# EAGLE design quad87 (EAGLE 7.7.0)
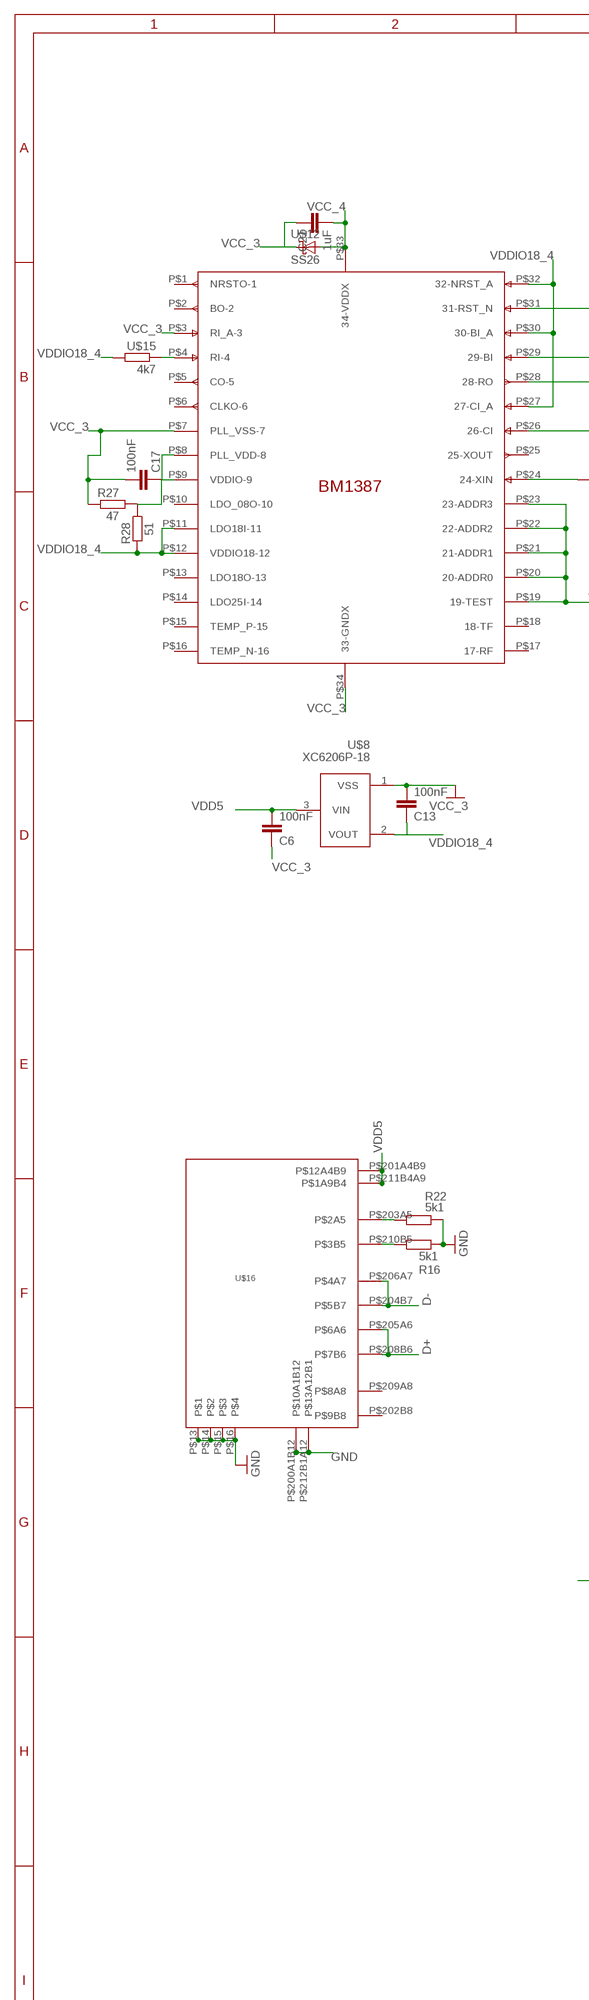
[diagram p0: schematic, sheet 1, part 1 of 2]
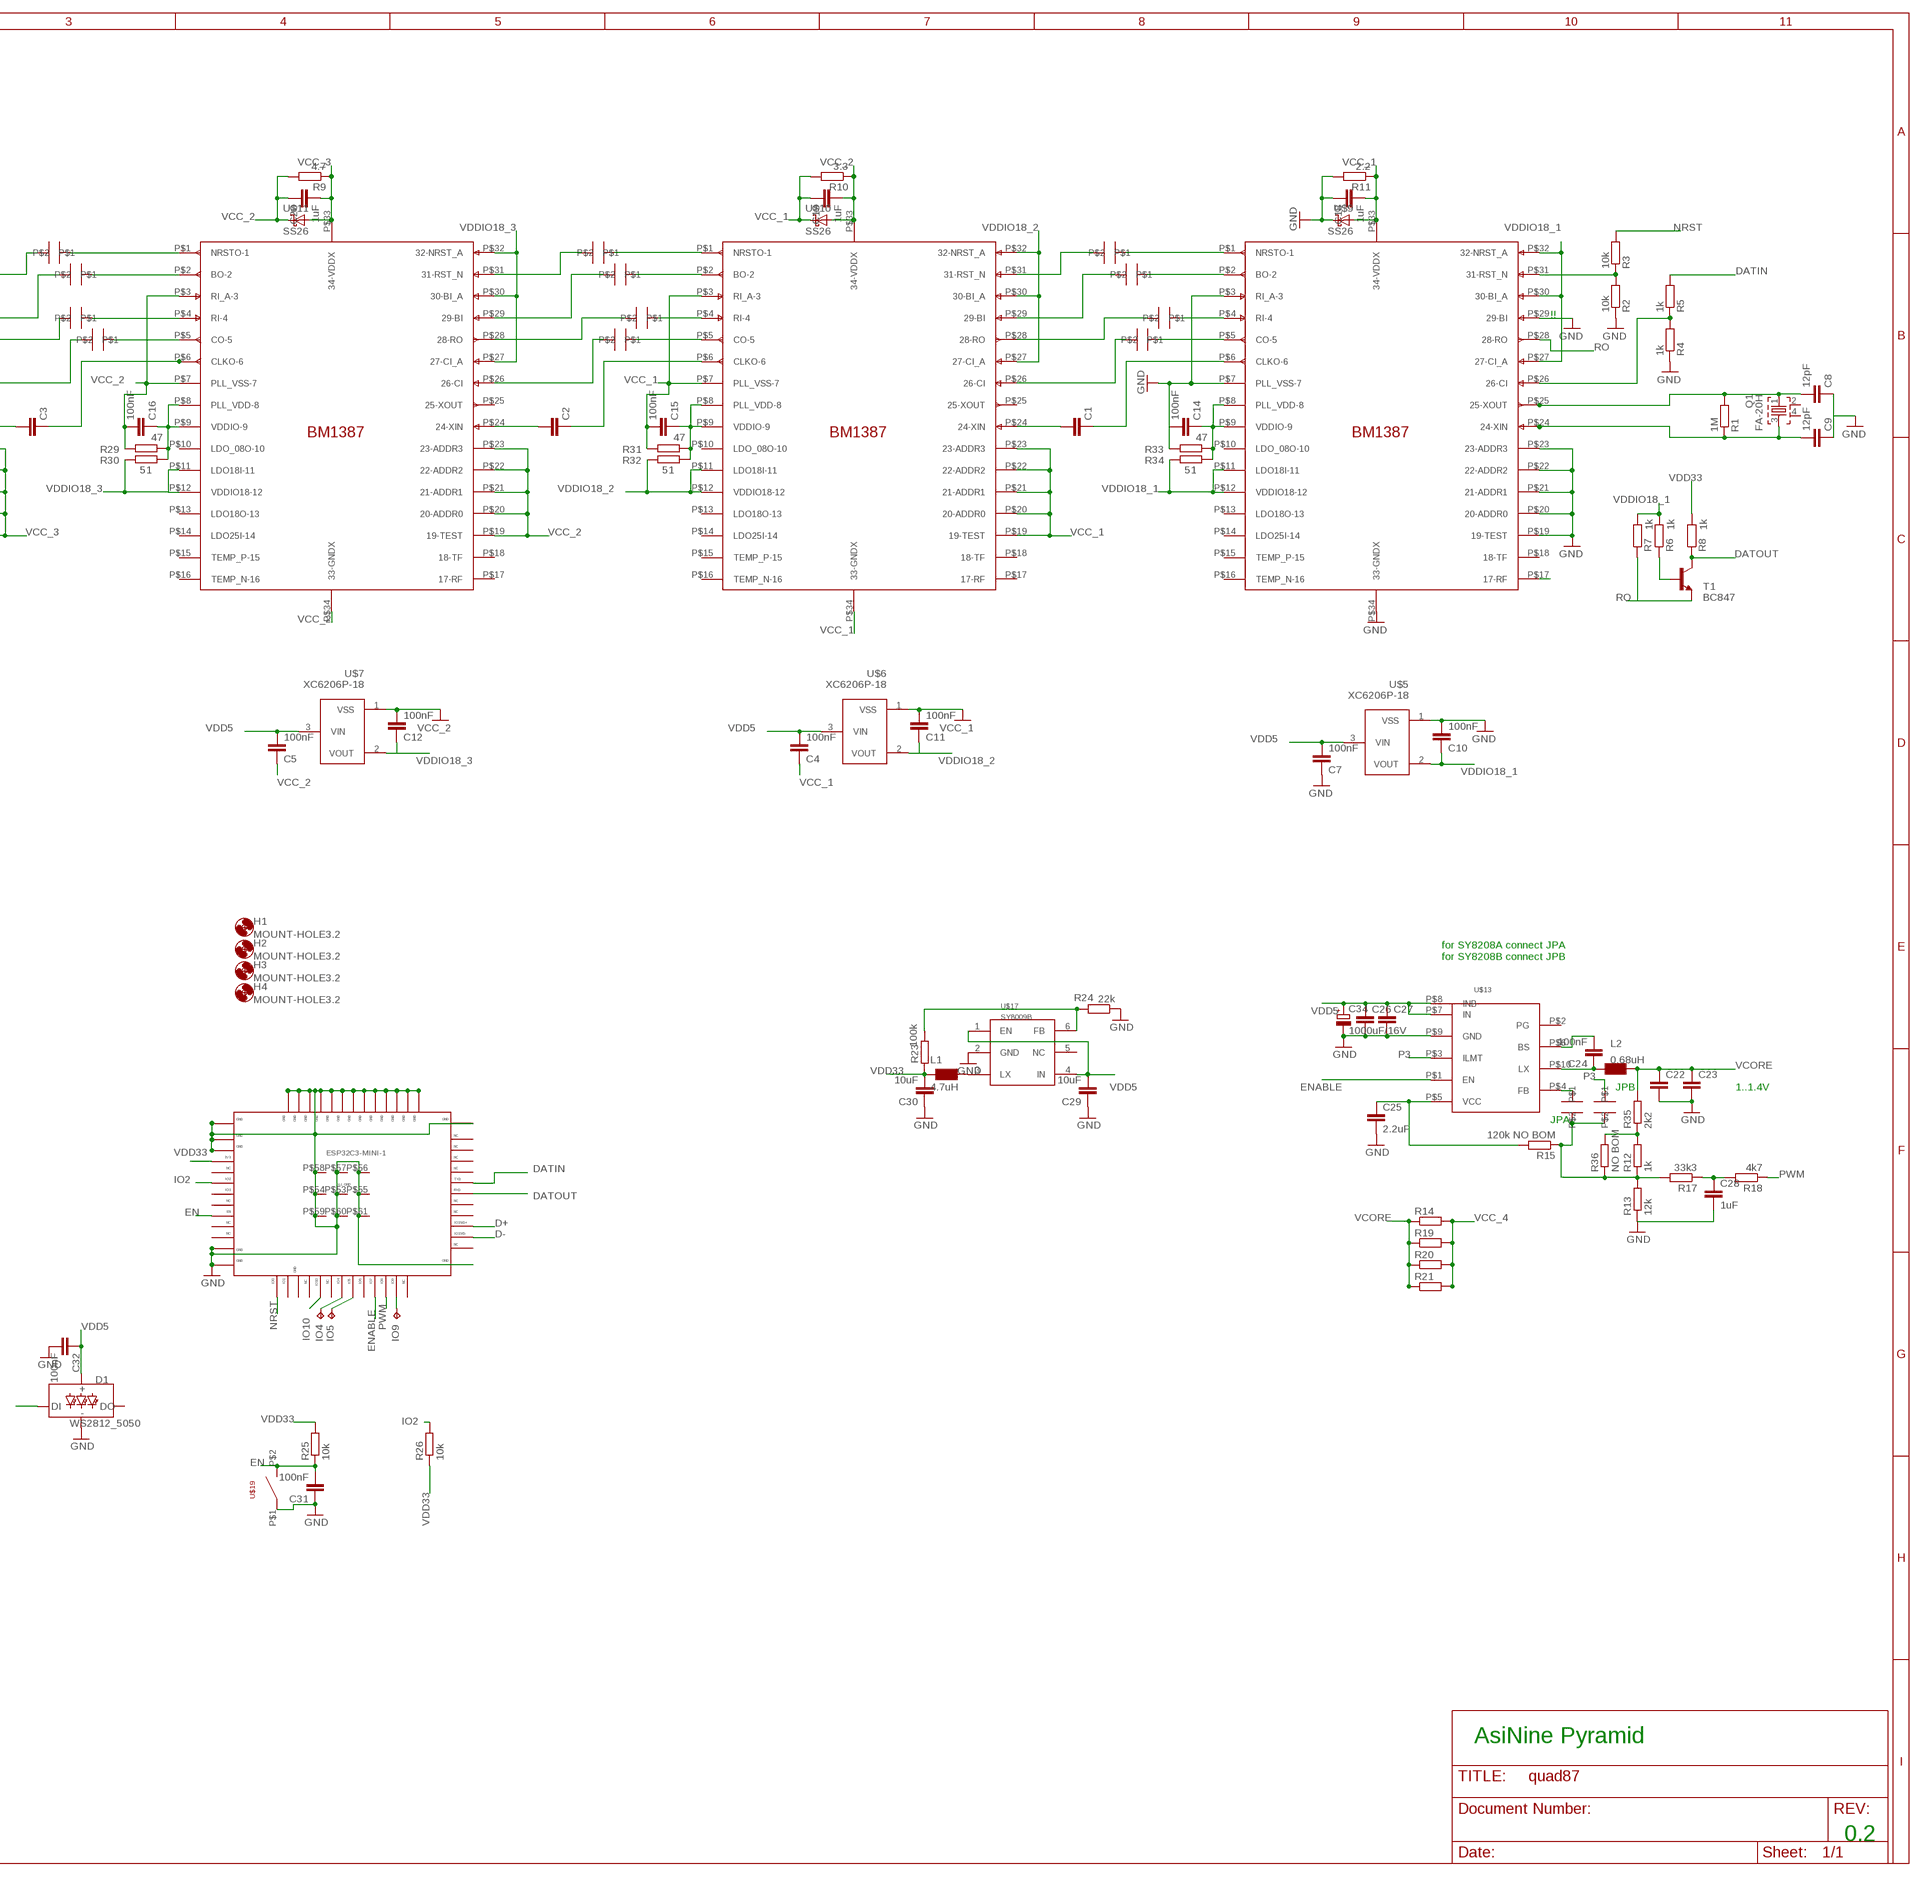
[diagram p1: schematic, sheet 1, part 2 of 2]

## Parts
C1  C-EUC0402  [C0402]
C2  C-EUC0402  [C0402]
C3  C-EUC0402  [C0402]
C4  100nF  C-EUC0603  [C0603]
C5  100nF  C-EUC0603  [C0603]
C6  100nF  C-EUC0603  [C0603]
C7  100nF  C-EUC0603  [C0603]
C8  12pF  C-EUC0402  [C0402]
C9  12pF  C-EUC0402  [C0402]
C10  100nF  C-EUC0603  [C0603]
C11  100nF  C-EUC0603  [C0603]
C12  100nF  C-EUC0603  [C0603]
C13  100nF  C-EUC0603  [C0603]
C14  100nF  C-EUC0402  [C0402]
C15  100nF  C-EUC0402  [C0402]
C16  100nF  C-EUC0402  [C0402]
C17  100nF  C-EUC0402  [C0402]
C18  1uF  C-EUC0603  [C0603]
C19  1uF  C-EUC0603  [C0603]
C20  1uF  C-EUC0603  [C0603]
C21  1uF  C-EUC0603  [C0603]
C22  C-EUC1210K  [C1210K]
C23  C-EUC1210K  [C1210K]
C24  100nF  C-EUC0603  [C0603]
C25  2.2uF  C-EUC0603  [C0603]
C26  C-EUC0805  [C0805]
C27  C-EUC0805  [C0805]
C28  1uF  C-EUC0603  [C0603]
C29  10uF  C-EUC0603  [C0603]
C30  10uF  C-EUC0603  [C0603]
C31  100nF  C-EUC0603  [C0603]
C32  100nF  C-EUC0603  [C0603]
C34  1000uF/16V  CPOL-EUTT5D10  [TT5D10]
D1  WS2812_5050  [WS2812-5X5-4PIN]
ESP32C3-MINI-1  ESP32-C3-MINI-1  ESP32C3MINI  [ESP32C3MINI]
H1  MOUNT-HOLE3.2  [3,2]
H2  MOUNT-HOLE3.2  [3,2]
H3  MOUNT-HOLE3.2  [3,2]
H4  MOUNT-HOLE3.2  [3,2]
IO4  TPB1,27  [B1,27]
IO5  TPB1,27  [B1,27]
IO9  TPB1,27  [B1,27]
JPA  SOLDERJUMPER  [SOLDERJUMPER]
JPB  SOLDERJUMPER  [SOLDERJUMPER]
L1  4.7uH  L0420  [L0420]
L2  0.68uH  L0630  [L0630]
Q1  FA-20H  [FA-20H]
R1  1M  R-EU_R0402  [R0402]
R2  10k  R-EU_R0402  [R0402]
R3  10k  R-EU_R0402  [R0402]
R4  1k  R-EU_R0603  [R0603]
R5  1k  R-EU_R0603  [R0603]
R6  1k  R-EU_R0603  [R0603]
R7  1k  R-EU_R0603  [R0603]
R8  1k  R-EU_R0603  [R0603]
R9  4.7  R-EU_R0603  [R0603]
R10  3.3  R-EU_R0603  [R0603]
R11  2.2  R-EU_R0603  [R0603]
R12  1k  R-EU_R0603  [R0603]
R13  12k  R-EU_R0603  [R0603]
R14  R-EU_R2010  [R2010]
R15  120k NO BOM  R-EU_R0603  [R0603]
R16  5k1  R-EU_R0402  [R0402]
R17  33k3  R-EU_R0603  [R0603]
R18  4k7  R-EU_R0603  [R0603]
R19  R-EU_R2010  [R2010]
R20  R-EU_R2010  [R2010]
R21  R-EU_R2010  [R2010]
R22  5k1  R-EU_R0402  [R0402]
R23  100k  R-EU_R0603  [R0603]
R24  22k  R-EU_R0603  [R0603]
R25  10k  R-EU_R0603  [R0603]
R26  10k  R-EU_R0603  [R0603]
R27  47  R-EU_R0402  [R0402]
R28  51  R-EU_R0402  [R0402]
R29  47  R-EU_R0402  [R0402]
R30  51  R-EU_R0402  [R0402]
R31  47  R-EU_R0402  [R0402]
R32  51  R-EU_R0402  [R0402]
R33  47  R-EU_R0402  [R0402]
R34  51  R-EU_R0402  [R0402]
R35  2k2  R-EU_R0603  [R0603]
R36  NO BOM  R-EU_R0603  [R0603]
T1  BC847  [SOT23]
U$1  BM1387A  [BM1391]
U$2  BM1387A  [BM1391]
U$3  BM1387A  [BM1391]
U$4  BM1387A  [BM1391]
U$5  XC6206P-18  XC6206P  [SOT23]
U$6  XC6206P-18  XC6206P  [SOT23]
U$7  XC6206P-18  XC6206P  [SOT23]
U$8  XC6206P-18  XC6206P  [SOT23]
U$9  SS26  [SS26]
U$10  SS26  [SS26]
U$11  SS26  [SS26]
U$12  SS26  [SS26]
U$13  SY8208  [SY8208]
U$15  4k7  R0603  [R0603]
U$16  USBCTHT  [USBCSMTTHT]
U$17  SY8009B  [SOT23-6]
U$19  SMDSW6X3  [SW6X3]
U$20  SOLDERJUMPER  [SOLDERJUMPER]
U$21  SOLDERJUMPER  [SOLDERJUMPER]
U$22  SOLDERJUMPER  [SOLDERJUMPER]
U$23  SOLDERJUMPER  [SOLDERJUMPER]
U$24  SOLDERJUMPER  [SOLDERJUMPER]
U$25  SOLDERJUMPER  [SOLDERJUMPER]
U$26  SOLDERJUMPER  [SOLDERJUMPER]
U$28  SOLDERJUMPER  [SOLDERJUMPER]
U$29  SOLDERJUMPER  [SOLDERJUMPER]
U$30  SOLDERJUMPER  [SOLDERJUMPER]
U$31  SOLDERJUMPER  [SOLDERJUMPER]
U$32  SOLDERJUMPER  [SOLDERJUMPER]

## Nets
CI: R4.2 R5.1 U$1.P$26(26-CI)
D+: ESP32C3-MINI-1.P$27 U$16.P$205A6(P$6A6) U$16.P$208B6(P$7B6)
D-: ESP32C3-MINI-1.P$26 U$16.P$204B7(P$5B7) U$16.P$206A7(P$4A7)
DATIN: ESP32C3-MINI-1.P$31 R5.2
DATOUT: ESP32C3-MINI-1.P$30 R8.1 T1.3(C)
EN: C31.2 ESP32C3-MINI-1.P$8 R25.1 U$19.P$2
ENABLE: ESP32C3-MINI-1.P$21 U$13.P$1(EN)
FB: JPA.P$1 JPB.P$1 R12.1 R13.2 R15.1 R17.2 R36.1
GND: C7.1 C8.1 C9.1 C10.2 C14.2 C18.1 C22.2 C23.2 C25.2 C26.2 C27.2 C28.2 C29.1 C30.1 C31.1 C32.2 C34.- D1.GND ESP32C3-MINI-1.P$1 ESP32C3-MINI-1.P$2 ESP32C3-MINI-1.P$11 ESP32C3-MINI-1.P$36 ESP32C3-MINI-1.P$37 ESP32C3-MINI-1.P$38 ESP32C3-MINI-1.P$39 ESP32C3-MINI-1.P$40 ESP32C3-MINI-1.P$41 ESP32C3-MINI-1.P$42 ESP32C3-MINI-1.P$43 ESP32C3-MINI-1.P$44 ESP32C3-MINI-1.P$45 ESP32C3-MINI-1.P$46 ESP32C3-MINI-1.P$47 ESP32C3-MINI-1.P$48 ESP32C3-MINI-1.P$49 ESP32C3-MINI-1.P$50 ESP32C3-MINI-1.P$51 ESP32C3-MINI-1.P$52 ESP32C3-MINI-1.P$53 ESP32C3-MINI-1.P$54 ESP32C3-MINI-1.P$55 ESP32C3-MINI-1.P$56 ESP32C3-MINI-1.P$57 ESP32C3-MINI-1.P$58 ESP32C3-MINI-1.P$59 ESP32C3-MINI-1.P$60 ESP32C3-MINI-1.P$61 R2.1 R4.1 R11.2 R13.1 R16.2 R22.2 R24.1 R33.2 U$1.P$3(RI_A-3) U$1.P$7(PLL_VSS-7) U$1.P$19(19-TEST) U$1.P$20(20-ADDR0) U$1.P$21(21-ADDR1) U$1.P$22(22-ADDR2) U$1.P$23(23-ADDR3) U$1.P$29(29-BI) U$1.P$34(33-GNDX) U$5.1(VSS) U$9.P$2(C) U$13.P$9(GND) U$16.P$13 U$16.P$14 U$16.P$15 U$16.P$16 U$16.P$200A1B12(P$10A1B12) U$16.P$212B1A12(P$13A12B1) U$17.2(GND) U$19.P$1
IO2: ESP32C3-MINI-1.P$5 R26.2
IO10: D1.DI ESP32C3-MINI-1.P$16
N$1: U$2.P$31(31-RST_N) U$29.P$1
N$2: U$3.P$31(31-RST_N) U$24.P$1
N$3: U$2.P$29(29-BI) U$30.P$1
N$4: U$3.P$29(29-BI) U$25.P$1
N$5: U$2.P$28(28-RO) U$31.P$1
N$6: U$3.P$28(28-RO) U$26.P$1
N$7: U$2.P$26(26-CI) U$32.P$1
N$8: U$3.P$26(26-CI) U$28.P$1
N$9: C1.1 U$1.P$6(CLKO-6)
N$10: C1.2 U$2.P$24(24-XIN)
N$11: C2.1 U$2.P$6(CLKO-6)
N$12: C2.2 U$3.P$24(24-XIN)
N$13: U$4.P$31(31-RST_N) U$20.P$1
N$14: U$4.P$29(29-BI) U$21.P$1
N$15: U$4.P$28(28-RO) U$22.P$1
N$16: U$4.P$26(26-CI) U$23.P$1
N$17: C3.1 U$3.P$6(CLKO-6)
N$18: C3.2 U$4.P$24(24-XIN)
N$19: C8.2 Q1.1 R1.2 U$1.P$25(25-XOUT)
N$20: C9.2 Q1.3 R1.1 U$1.P$24(24-XIN)
N$21: R16.1 U$16.P$210B5(P$3B5)
N$22: R22.1 U$16.P$203A5(P$2A5)
N$23: L1.P$2 U$17.3(LX)
N$24: R23.2 R24.2 U$17.6(FB)
N$25: R2.2 R3.1 U$1.P$31(31-RST_N)
N$27: R6.1 T1.1(B)
N$28: R12.2 R35.1 R36.2
N$29: C14.1 R33.1 R34.1 U$1.P$8(PLL_VDD-8) U$1.P$9(VDDIO-9)
N$30: C15.1 R31.1 R32.1 U$2.P$8(PLL_VDD-8) U$2.P$9(VDDIO-9)
N$31: C17.1 R27.1 R28.1 U$4.P$8(PLL_VDD-8) U$4.P$9(VDDIO-9)
N$32: U$4.P$4(RI-4) U$15.1
N$33: JPA.P$2 U$13.P$4(FB)
N$34: C24.1 L2.P$1 U$13.P$10(LX)
N$35: C24.2 U$13.P$6(BS)
N$36: U$1.P$17(17-RF)
N$37: ESP32C3-MINI-1.P$18 IO4.TP
N$39: C28.1 R17.1 R18.2
N$40: ESP32C3-MINI-1.P$19 IO5.TP
N$41: ESP32C3-MINI-1.P$23 IO9.TP
N$43: U$3.P$1(NRSTO-1) U$20.P$2
N$44: U$3.P$2(BO-2) U$21.P$2
N$45: U$3.P$4(RI-4) U$22.P$2
N$46: U$3.P$5(CO-5) U$23.P$2
N$47: U$2.P$1(NRSTO-1) U$24.P$2
N$48: U$2.P$2(BO-2) U$25.P$2
N$49: U$2.P$4(RI-4) U$26.P$2
N$50: U$2.P$5(CO-5) U$28.P$2
N$51: U$1.P$1(NRSTO-1) U$29.P$2
N$52: U$1.P$2(BO-2) U$30.P$2
N$53: U$1.P$4(RI-4) U$31.P$2
N$54: U$1.P$5(CO-5) U$32.P$2
N$55: C16.1 R29.1 R30.1 U$3.P$8(PLL_VDD-8) U$3.P$9(VDDIO-9)
NRST: ESP32C3-MINI-1.P$12 R3.2
P3: JPB.P$2 U$13.P$3(ILMT)
PWM: ESP32C3-MINI-1.P$22 R18.1
RO: R7.1 T1.2(E) U$1.P$28(28-RO)
VCC_1: C4.1 C11.2 C15.2 C18.2 C19.1 R10.2 R11.1 R31.2 U$1.P$33(34-VDDX) U$2.P$3(RI_A-3) U$2.P$7(PLL_VSS-7) U$2.P$19(19-TEST) U$2.P$20(20-ADDR0) U$2.P$21(21-ADDR1) U$2.P$22(22-ADDR2) U$2.P$23(23-ADDR3) U$2.P$34(33-GNDX) U$6.1(VSS) U$9.P$1(A) U$10.P$2(C)
VCC_2: C5.1 C12.2 C16.2 C19.2 C20.1 R9.2 R10.1 R29.2 U$2.P$33(34-VDDX) U$3.P$3(RI_A-3) U$3.P$7(PLL_VSS-7) U$3.P$19(19-TEST) U$3.P$20(20-ADDR0) U$3.P$21(21-ADDR1) U$3.P$22(22-ADDR2) U$3.P$23(23-ADDR3) U$3.P$34(33-GNDX) U$7.1(VSS) U$10.P$1(A) U$11.P$2(C)
VCC_3: C6.1 C13.2 C17.2 C20.2 C21.1 R9.1 R27.2 U$3.P$33(34-VDDX) U$4.P$3(RI_A-3) U$4.P$7(PLL_VSS-7) U$4.P$19(19-TEST) U$4.P$20(20-ADDR0) U$4.P$21(21-ADDR1) U$4.P$22(22-ADDR2) U$4.P$23(23-ADDR3) U$4.P$34(33-GNDX) U$8.1(VSS) U$11.P$1(A) U$12.P$2(C)
VCC_4: C21.2 R14.2 R19.2 R20.2 R21.2 U$4.P$33(34-VDDX) U$12.P$1(A)
VCORE: C22.1 C23.1 L2.P$2 R14.1 R19.1 R20.1 R21.1 R35.2
VDD5: C4.2 C5.2 C6.2 C7.2 C26.1 C27.1 C29.2 C32.1 C34.+ D1.VCC U$5.3(VIN) U$6.3(VIN) U$7.3(VIN) U$8.3(VIN) U$13.P$7(IN) U$13.P$8(INB) U$16.P$201A4B9(P$12A4B9) U$16.P$211B4A9(P$1A9B4) U$17.1(EN) U$17.4(IN)
VDD33: C30.2 ESP32C3-MINI-1.P$3 L1.P$1 R8.2 R23.1 R25.2 R26.1
VDD33I: C25.1 R15.2 U$13.P$5(VCC)
VDDIO18_1: C10.1 R6.2 R7.2 R34.2 U$1.P$11(LDO18I-11) U$1.P$12(VDDIO18-12) U$1.P$27(27-CI_A) U$1.P$30(30-BI_A) U$1.P$32(32-NRST_A) U$5.2(VOUT)
VDDIO18_2: C11.1 R32.2 U$2.P$11(LDO18I-11) U$2.P$12(VDDIO18-12) U$2.P$27(27-CI_A) U$2.P$30(30-BI_A) U$2.P$32(32-NRST_A) U$6.2(VOUT)
VDDIO18_3: C12.1 R30.2 U$3.P$11(LDO18I-11) U$3.P$12(VDDIO18-12) U$3.P$27(27-CI_A) U$3.P$30(30-BI_A) U$3.P$32(32-NRST_A) U$7.2(VOUT)
VDDIO18_4: C13.1 R28.2 U$4.P$11(LDO18I-11) U$4.P$12(VDDIO18-12) U$4.P$27(27-CI_A) U$4.P$30(30-BI_A) U$4.P$32(32-NRST_A) U$8.2(VOUT) U$15.2
Unconnected: D1.DO ESP32C3-MINI-1.P$4 ESP32C3-MINI-1.P$6 ESP32C3-MINI-1.P$7 ESP32C3-MINI-1.P$9 ESP32C3-MINI-1.P$10 ESP32C3-MINI-1.P$13 ESP32C3-MINI-1.P$14 ESP32C3-MINI-1.P$15 ESP32C3-MINI-1.P$17 ESP32C3-MINI-1.P$20 ESP32C3-MINI-1.P$24 ESP32C3-MINI-1.P$25 ESP32C3-MINI-1.P$28 ESP32C3-MINI-1.P$29 ESP32C3-MINI-1.P$32 ESP32C3-MINI-1.P$33 ESP32C3-MINI-1.P$34 ESP32C3-MINI-1.P$35 Q1.2 Q1.4 U$1.P$10(LDO_08O-10) U$1.P$13(LDO18O-13) U$1.P$14(LDO25I-14) U$1.P$15(TEMP_P-15) U$1.P$16(TEMP_N-16) U$1.P$18(18-TF) U$2.P$10(LDO_08O-10) U$2.P$13(LDO18O-13) U$2.P$14(LDO25I-14) U$2.P$15(TEMP_P-15) U$2.P$16(TEMP_N-16) U$2.P$17(17-RF) U$2.P$18(18-TF) U$2.P$25(25-XOUT) U$3.P$10(LDO_08O-10) U$3.P$13(LDO18O-13) U$3.P$14(LDO25I-14) U$3.P$15(TEMP_P-15) U$3.P$16(TEMP_N-16) U$3.P$17(17-RF) U$3.P$18(18-TF) U$3.P$25(25-XOUT) U$4.P$1(NRSTO-1) U$4.P$2(BO-2) U$4.P$5(CO-5) U$4.P$6(CLKO-6) U$4.P$10(LDO_08O-10) U$4.P$13(LDO18O-13) U$4.P$14(LDO25I-14) U$4.P$15(TEMP_P-15) U$4.P$16(TEMP_N-16) U$4.P$17(17-RF) U$4.P$18(18-TF) U$4.P$25(25-XOUT) U$13.P$2(PG) U$16.P$202B8(P$9B8) U$16.P$209A8(P$8A8) U$17.5(NC)

## Notes on the sheet
- !!
- for SY8208A connect JPA
  for SY8208B connect JPB
- JPB | 1..1.4V
- JPA
- AsiNine Pyramid
- 0.2

## Library data of the parts
C1-C32 = rcl:C-EU: CAPACITOR, European symbol
C34 = rcl:CPOL-EU: POLARIZED CAPACITOR, European symbol
D1 = SparkFun-LED:WS2812: Addressable RGB LED - 1 Wire Common names: WS2812, SK6812, Neopixel, APA-106, etc. SMD LED with built-in controller IC. Color: Red/Green/Blue SparkFun Products: LED-SMD RGB (WS2812) <https://www.sparkfun.com/products/11821> LED - RGB Addressable, PTH, 5mm Diffused (5 Pack) <https://www.sparkfun.com/products/12986> LED - RGB Addressable, PTH, 5mm Clear (5 Pack) <https://www.sparkfun.com/products/12999> Blynk Board - ESP8266 <https://www.sparkfun.com/products/13794> Datasheet referenced for footprint: WS2812B-PTH <https://cdn.sparkfun.com/datasheets/Components/LED/COM-12877.pdf>; PROD_ID: DIO-12503
ESP32C3-MINI-1 = esp32c3:ESP32C3MINI
H1-H4 = holes:MOUNT-HOLE: MOUNTING HOLE with drill center marker
IO4 IO5 IO9 = testpad:TP: Test pad
JPA JPB U$20-U$26 U$28-U$32 = vishay-fet:SOLDERJUMPER
L1 = vishay-fet:L0420
L2 = vishay-fet:L0630
Q1 = crystal:FA-: MHz RANGE CRYSTAL UNIT Source: Epson Toyocom
R1-R36 = rcl:R-EU_: RESISTOR, European symbol
T1 = transistor:BC847: NPN TRANSISTOR
U$1-U$4 = bm1387:BM1387A
U$5-U$8 = vishay-fet:XC6206P
U$9-U$12 = vishay-fet:SS26
U$13 = vishay-fet:SY8208
U$15 = vishay-fet:R0603
U$16 = usbc:USBC
U$17 = vishay-fet:SY8009B
U$19 = vishay-fet:SMDSW6X3

## Board
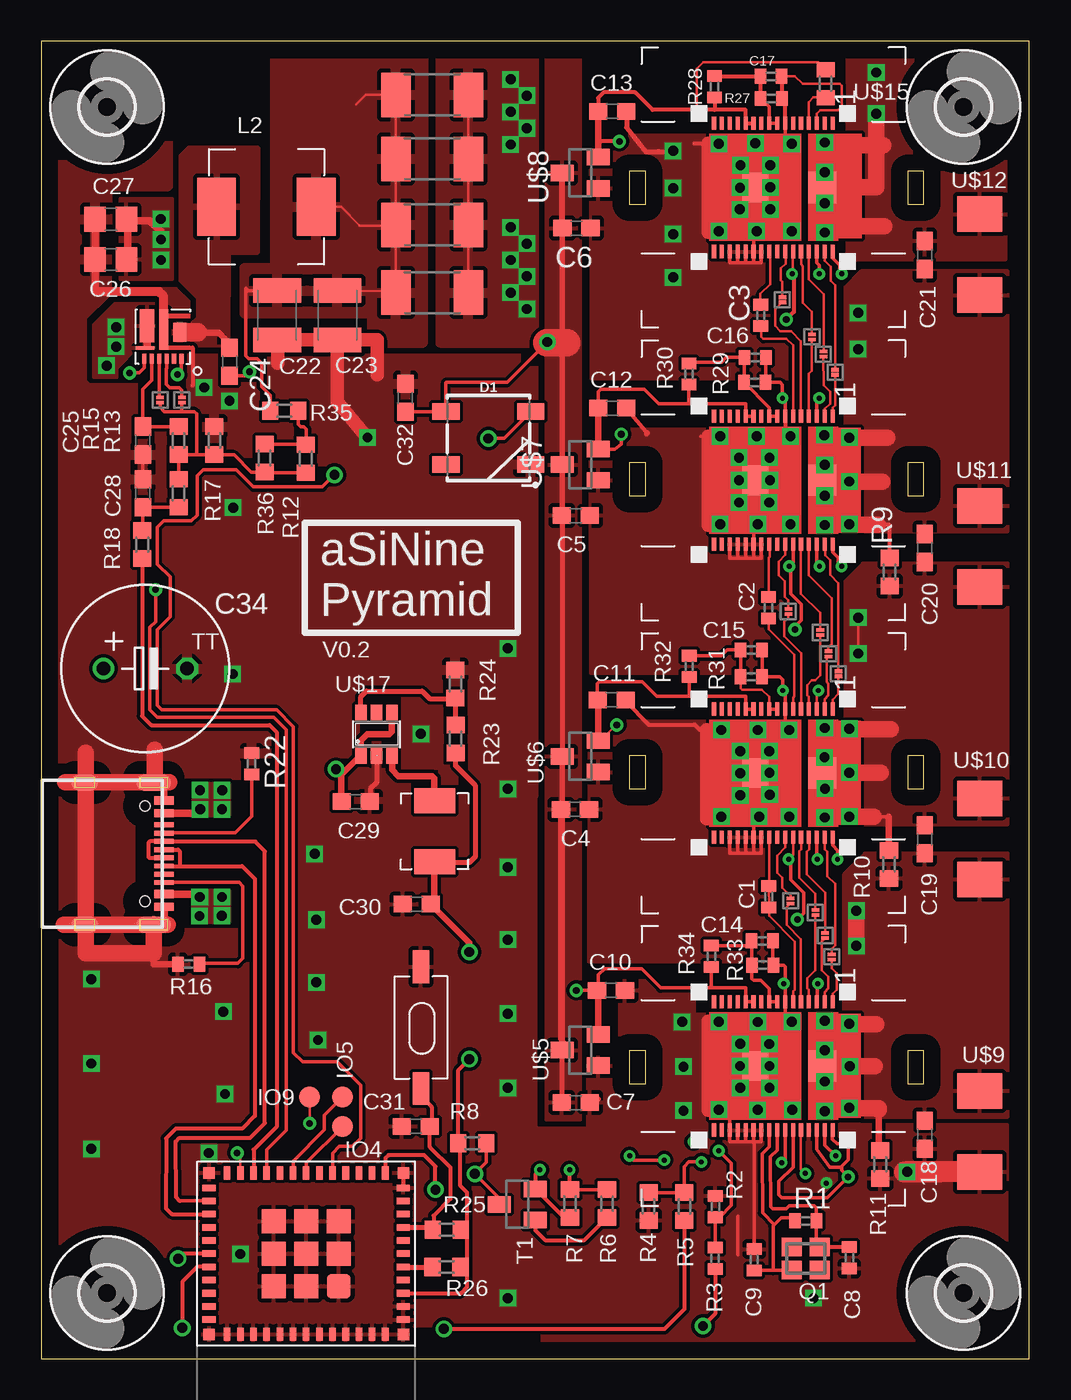
[diagram p2: board, top side]
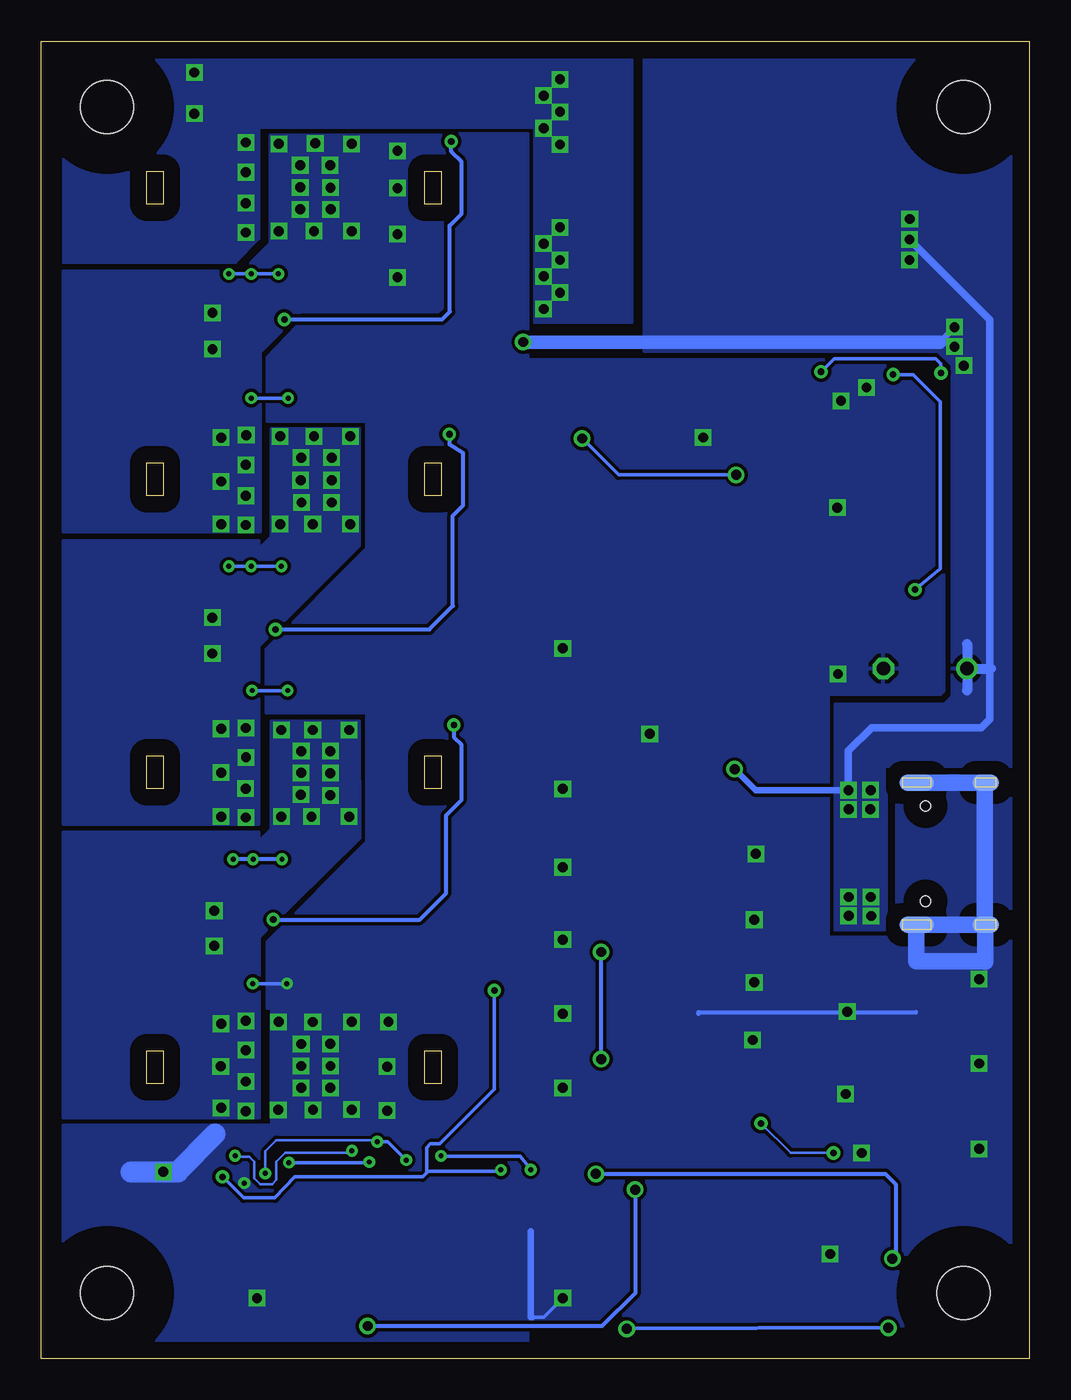
[diagram p3: board, bottom side, seen from below]

Size 60 x 80 mm. Coordinates in mm from the lower left corner, seen from the top.
Outline: 0,0 60,0 60,80 0,80 0,0
Outline: 52.6,72.1 52.6,70.1 53.6,70.1 53.6,72.1 52.6,72.1
Outline: 35.7,72.1 35.7,70.1 36.7,70.1 36.7,72.1 35.7,72.1
Outline: 52.6,54.4 52.6,52.4 53.6,52.4 53.6,54.4 52.6,54.4
Outline: 35.7,54.4 35.7,52.4 36.7,52.4 36.7,54.4 35.7,54.4
Outline: 52.6,36.6 52.6,34.6 53.6,34.6 53.6,36.6 52.6,36.6
Outline: 35.7,36.6 35.7,34.6 36.7,34.6 36.7,36.6 35.7,36.6
Outline: 52.6,18.7 52.6,16.7 53.6,16.7 53.6,18.7 52.6,18.7
Outline: 35.7,18.7 35.7,16.7 36.7,16.7 36.7,18.7 35.7,18.7
Copper layers (1*16): Top 0.035mm / dielectric 1.5mm / Bottom 0.035mm
Design rules "default": minimum track width 10mil, minimum drill 24mil, track to track 8mil, track to pad 8mil, pad to pad 8mil, via to via 8mil, smd to smd 8mil, copper to edge 40mil, drill to drill 8mil, minimum pad ring 10mil, minimum via ring 8mil, stop-mask expansion 4mil, vias tented up to drill 0mil, thermal gap 10mil
tRestrict: area 3.9,0.1 to 9.7,1.9; area 3.9,0.1 to 9.7,1.9; area 22.4,0.3 to 30.3,1.9
bRestrict: area 3.9,0.1 to 9.7,1.9; area 22.4,0.3 to 26.4,1.9

### Footprints (pad centres in the part's own frame; a part is rotated, then mirrored left to right if it is on the bottom)
C0402 = smd 0.7 x 0.9: 1 -0.65,0; 2 0.65,0
C0603 = smd 1.1 x 1: 1 -0.85,0; 2 0.85,0
C1210K = smd 1.5 x 2.9: 1 -1.5,0; 2 1.5,0
C0805 = smd 1.3 x 1.5: 1 -0.95,0; 2 0.95,0
TT5D10 = drill 0.813: + -2.54,0 | drill 0.813 octagon: - 2.54,0
WS2812-5X5-4PIN = smd 1.651 x 1: DI 2.577,1.6; DO -2.577,-1.6; GND 2.577,-1.6; VCC -2.577,1.6
ESP32C3MINI = smd 0.8 x 0.4: P$1 -5.9,4; P$2 -5.9,3.2; P$3 -5.9,2.4; P$4 -5.9,1.6; P$5 -5.9,0.8; P$6 -5.9,0; P$7 -5.9,-0.8; P$8 -5.9,-1.6; P$9 -5.9,-2.4; P$10 -5.9,-3.2; P$11 -5.9,-4; P$25 5.9,-4; P$26 5.9,-3.2; P$27 5.9,-2.4; P$28 5.9,-1.6; P$29 5.9,-0.8; P$30 5.9,0; P$31 5.9,0.8; P$32 5.9,1.6; P$33 5.9,2.4; P$34 5.9,3.2; P$35 5.9,4 | smd 0.4 x 0.8: P$12 -4.8,-4.9; P$13 -4,-4.9; P$14 -3.2,-4.9; P$15 -2.4,-4.9; P$16 -1.6,-4.9; P$17 -0.8,-4.9; P$18 0,-4.9; P$19 0.8,-4.9; P$20 1.6,-4.9; P$21 2.4,-4.9; P$22 3.2,-4.9; P$23 4,-4.9; P$24 4.8,-4.9; P$36 4.8,4.9; P$37 4,4.9; P$38 3.2,4.9; P$39 2.4,4.9; P$40 1.6,4.9; P$41 0.8,4.9; P$42 0,4.9; P$43 -0.8,4.9; P$44 -1.6,4.9; P$45 -2.4,4.9; P$46 -3.2,4.9; P$47 -4,4.9; P$48 -4.8,4.9 | smd 0.7 x 0.7: P$49 5.9,4.9; P$50 5.9,-4.9; P$51 -5.9,-4.9; P$52 -5.9,4.9 | smd 1.45 x 1.45: P$53 0,0; P$54 1.975,0; P$55 -1.975,0; P$56 -1.975,1.975; P$57 0,1.975; P$58 1.975,1.975; P$59 1.975,-1.975; P$60 0,-1.975; P$61 -1.975,-1.975
3,2 = hole 3.2: 0,0
B1,27 = smd 1.27 x 1.27: TP 0,0
SOLDERJUMPER = smd 0.229 x 0.457: P$1 -0.152,0; P$2 0.152,0
L0420 = smd 1.5 x 2.5: P$1 -1.85,0; P$2 1.85,0
L0630 = smd 2.35 x 3.5: P$1 -3.025,0; P$2 3.025,0
FA-20H = smd 1.2 x 1.1: 1 -0.85,-0.7; 2 0.85,-0.7; 3 0.85,0.7; 4 -0.85,0.7
R0402 = smd 0.7 x 0.9: 1 -0.65,0; 2 0.65,0
R0603 = smd 1 x 1.1: 1 -0.85,0; 2 0.85,0
R2010 = smd 1.8 x 2.7: 1 -2.2,0; 2 2.2,0
SOT23 = smd 1 x 1.4: 1 -0.95,-1.1; 2 0.95,-1.1; 3 0,1.1
BM1391 = smd 0.8 x 0.25: P$1 3.89,-3.6; P$2 3.89,-3.12; P$3 3.89,-2.64; P$4 3.89,-2.16; P$5 3.89,-1.68; P$6 3.89,-1.2; P$7 3.89,-0.72; P$8 3.89,-0.24; P$9 3.89,0.24; P$10 3.89,0.72; P$11 3.89,1.2; P$12 3.89,1.68; P$13 3.89,2.16; P$14 3.89,2.64; P$15 3.89,3.12; P$16 3.89,3.6; P$17 -3.89,3.6; P$18 -3.89,3.12; P$19 -3.89,2.64; P$20 -3.89,2.16; P$21 -3.89,1.68; P$22 -3.89,1.2; P$23 -3.89,0.72; P$24 -3.89,0.24; P$25 -3.89,-0.24; P$26 -3.89,-0.72; P$27 -3.89,-1.2; P$28 -3.89,-1.68; P$29 -3.89,-2.16; P$30 -3.89,-2.64; P$31 -3.89,-3.12; P$32 -3.89,-3.6 | smd 1.9 x 1.7: P$33 0,-2.98 | smd 1.8 x 1.6: P$34 0,1.1
SS26 = smd 2.159 x 2.743: P$1 -2.48,0.07; P$2 2.44,0.07
SY8208 = smd 0.25 x 0.6: P$1 -1.125,1.35; P$2 -0.675,1.35; P$3 -0.225,1.35; P$4 0.225,1.35; P$5 0.675,1.35; P$6 1.125,1.35 | smd 1.12 x 0.225: P$7 1.09,0.69 | smd 0.87 x 2: P$8 0.965,-0.645 | smd 0.555 x 2.45: P$9 -0.05,-0.425 | smd 0.775 x 1.15: P$10 -1.02,-0.25
R0603' = smd 0.889 x 1.1: 1 -0.85,0; 2 0.85,0
USBCSMTTHT = smd 1 x 1.6 bottom: P$1 -4.32,2.6; P$2 4.32,2.6 | smd 1 x 2.1 bottom: P$6 4.32,6.78; P$115 -4.32,6.78 | smd 1 x 1.6: P$13 -4.32,2.6; P$14 4.32,2.6 | smd 1 x 2.1: P$15 -4.32,6.78; P$16 4.32,6.78 | smd 0.5 x 1.2: P$200A1B12 -3.225,7.4; P$201A4B9 -2.45,7.4; P$211B4A9 2.45,7.4; P$212B1A12 3.225,7.4 | smd 0.3 x 1.2: P$202B8 -1.75,7.4; P$203A5 -1.25,7.4; P$204B7 -0.75,7.4; P$205A6 -0.25,7.4; P$206A7 0.25,7.4; P$208B6 0.75,7.4; P$209A8 1.25,7.4; P$210B5 1.75,7.4 | hole 0.6: 2.89,6.25; -2.89,6.25
SOT23-6 = smd 0.69 x 0.99: 1 -0.95,-1.29; 2 0,-1.29; 3 0.95,-1.29; 4 0.95,1.3; 5 -0.003,1.3; 6 -0.95,1.3
SW6X3 = smd 2 x 1: P$1 -3.7,0; P$2 3.7,0

### Placement (x,y rotation side)
C1  44.17,28.05 90 top
C2  44.16,45.59 90 top
C3  43.69,63.35 90 top
C4  32.41,33.36 180 top
C5  32.46,51.21 180 top
C6  32.5,68.66 180 top
C7  32.46,15.57 180 top
C8  49.07,6.14 90 top
C9  43.29,6.02 270 top
C10  34.59,22.36 0 top
C11  34.63,40.01 0 top
C12  34.67,57.72 0 top
C13  34.67,75.74 0 top
C14  43.78,25.37 0 top
C15  43.12,43.04 0 top
C16  43.35,60.79 0 top
C17  44.31,77.87 0 top
C18  53.64,13.6 90 top
C19  53.64,31.55 90 top
C20  53.64,49.23 90 top
C21  53.64,67.02 90 top
C22  14.33,63.36 270 top
C23  17.99,63.36 270 top
C24  11.43,60.54 270 top
C25  6.17,55.75 270 top
C26  4.23,66.75 180 top
C27  4.23,69.19 180 top
C28  6.17,52.55 90 top
C29  19.09,33.83 180 top
C30  22.81,27.6 0 top
C31  22.75,14.11 0 top
C32  22.12,58.34 90 top
C34  6.32,41.91 0 top
D1  27.15,55.91 0 top
ESP32C3-MINI-1  16.09,6.38 180 top
H1  4,4 0 top
H2  56,4 0 top
H3  4,76 0 top
H4  56,76 0 top
IO4  18.3,14.1 0 top
IO5  18.3,15.9 0 top
IO9  16.3,15.9 0 top
JPA  7.22,58.22 90 top
JPB  8.54,58.22 90 top
L1  23.89,32.03 90 top
L2  13.68,69.95 0 top
Q1  46.42,6.09 180 top
R1  46.42,8.38 0 top
R2  40.93,9.25 270 top
R3  40.92,6.1 270 top
R4  36.88,9.26 90 top
R5  39.05,9.25 270 top
R6  34.35,9.42 90 top
R7  32.1,9.43 90 top
R8  26.17,13.09 180 top
R9  51.51,47.78 270 top
R10  51.47,30.02 270 top
R11  50.94,11.81 270 top
R12  16.07,54.65 90 top
R13  10.52,55.75 270 top
R14  23.74,64.73 0 top
R15  8.34,55.75 90 top
R16  8.95,23.96 180 top
R17  8.34,52.55 90 top
R18  6.13,49.43 90 top
R19  23.74,68.85 0 top
R20  23.74,72.85 0 top
R21  23.74,76.73 0 top
R22  12.78,36.12 90 top
R23  25.16,37.64 90 top
R24  25.15,40.97 270 top
R25  24.62,7.84 0 top
R26  24.62,5.58 180 top
R27  44.34,76.52 0 top
R28  40.88,77.23 270 top
R29  43.33,59.28 0 top
R30  39.33,59.79 270 top
R31  43.12,41.41 0 top
R32  39.34,42.04 270 top
R33  43.8,23.9 0 top
R34  40.69,24.43 270 top
R35  14.76,57.56 180 top
R36  13.56,54.69 90 top
T1  28.9,9.37 90 top
U$1  44.45,17.78 90 top
U$2  44.45,35.56 90 top
U$3  44.45,53.34 90 top
U$4  44.45,71.12 90 top
U$5  32.73,18.75 90 top
U$6  32.73,36.58 90 top
U$7  32.73,54.29 90 top
U$8  32.73,72.01 90 top
U$9  56.92,13.79 270 top
U$10  56.92,31.55 270 top
U$11  56.92,49.3 270 top
U$12  56.92,67.02 270 top
U$13  7.39,62.06 180 top
U$15  4k7  [R0603']  47.62,77.42 90 top
U$16  0.05,30.67 270 top
U$17  20.36,37.92 0 top
U$19  23.06,20.11 270 top
U$20  48.2,59.9 270 top
U$21  47.49,61 270 top
U$22  46.8,62.04 270 top
U$23  45,64.3 270 top
U$24  48.4,41.6 270 top
U$25  47.8,42.8 270 top
U$26  47.3,44.1 270 top
U$28  45.37,45.37 270 top
U$29  48,24.4 270 top
U$30  47.6,25.7 270 top
U$31  47,27.1 270 top
U$32  45.5,27.8 270 top

### Tracks (layer width: path | path; a pad name or v marks a point on that pad's centre or on a via)
CI  (via drill 0.3)
  Top 0.203: U$1.P$26 45.17,12.13 v44.96,11.91 | v40.08,11.95 39.33,11.95 39.05,11.67 R5.1 36.89,10.1 R4.2
  Bottom 0.203: v44.96,11.91 40.12,11.91 v40.08,11.95
D+
  Top 0.203: 8.29,30.92
  Top 0.254: U$16.P$208B6 8.36,29.92 | 8.36,29.92 8.43,30 8.43,30.79 8.29,30.92 | U$16.P$205A6 8.29,30.92 | 8.36,29.92 12.21,29.92 12.98,29.15 12.98,14.76 12.21,13.98 8.18,13.98 7.58,13.39 7.58,9.14 7.93,8.79 10.18,8.79 ESP32C3-MINI-1.P$27
D-
  Top 0.254: U$16.P$206A7 6.57,30.42 6.5,30.48 6.5,31.33 6.59,31.42 U$16.P$204B7 7.48,31.39 13.01,31.39 13.59,30.81 13.59,14.31 12.69,13.41 8.39,13.41 8.17,13.18 8.19,9.82 8.42,9.57 ESP32C3-MINI-1.P$26
DATIN  (via drill 0.6 pad 0.61)
  Top 0.254: 39.1,8.35 R5.2 39.06,8.38 39.06,3.04 37.85,1.82 v24.45,1.82 | ESP32C3-MINI-1.P$31 9.47,5.58 8.57,4.67 v8.57,1.88
  Bottom 0.254: v8.57,1.88 v24.45,1.82
DATOUT  (via drill 0.6 pad 0.61)
  Top 0.152: 26.35,11.2 v26.33,11.23
  Top 0.203: R8.1 27.02,11.92 v26.33,11.23 27.8,9.75 T1.3
  Top 0.254: ESP32C3-MINI-1.P$30 8.62,6.38 v8.32,6.08
  Bottom 0.254: v26.33,11.23 8.74,11.23 8.12,10.6 8.12,6.29 v8.32,6.08
EN
  Top 0.254: 23.64,7.68 R25.1 | 24.02,8.06 R25.1 | 23.66,7.96 R25.1 | 23.96,14.15 C31.2 | R25.1 23.82,7.75 23.82,8.7 24.84,9.72 24.84,11.62 23.6,12.86 C31.2 | U$19.P$2 23.06,15.94 23.7,15.3 23.7,14.21 C31.2
  Top 0.305: 23.66,7.96 22.03,7.96 ESP32C3-MINI-1.P$8
ENABLE  (via drill 0.4)
  Top 0.203: U$13.P$1 8.52,60 v8.27,59.76 | v6.95,46.7 6.95,44.77 6.59,44.41 6.59,39.42 7.06,38.95 14.12,38.95 14.88,38.19 14.88,13.88 13.7,12.7 13.7,11.29 ESP32C3-MINI-1.P$21
  Bottom 0.203: v8.27,59.76 7.04,59.76 5.41,58.12 5.41,47.97 v6.95,46.7
FB
  Top 0.203: R17.2 R15.1 9.44,54.9 | 9.44,54.9 9.44,57.37 9.29,57.51 8.54,57.51 | 9.44,54.9 R13.2 11.71,54.89 12.76,53.84 R36.1 13.6,53.8 R12.1 | 8.54,57.51 7.49,57.51 7.22,57.77 JPA.P$1 | JPB.P$1 8.54,57.51
GND  (via drill 0.3, 0.6)
  Top 0.152: U$1.P$22 arc-249 43.28,13.87 43.28,13.18 42.79,13.18 41.83,13.18 | U$1.P$3 47.1,21.67 | 45.17,19.6 U$1.P$34 | 42.29,20.46 v41.15,20.46 41.11,20.5 40.5,20.5 | v41.15,15.13 41.81,15.13 41.81,15.24 | 41.81,16.24 42.29,16.24 v42.44,16.45 | 41.1,17.78 41.15,17.78 41.15,17.75 | 43.73,13.65 43.74,13.64
  Top 0.203: U$1.P$19 41.83,13.89 | U$1.P$19 41.81,13.18 41.83,13.18 42.29,13.18 U$1.P$20 42.29,13.18 42.77,13.18 | U$1.P$21 42.77,13.18 | U$1.P$22 43.25,13.18 | 43.25,13.18 42.79,13.18 42.77,13.18 | 42.29,6.33 42.29,8.65 | U$1.P$19 41.81,15.24 41.81,16.24 U$1.P$34 43.34,17.8 | 45.17,19.6 U$1.P$7 45.17,22.7 v45.09,22.78 45.19,22.89 45.19,23.8 45.09,23.9 R33.2 44.43,23.8 C14.2 | C28.2 C25.2 | 43.28,13.18 43.73,13.18 43.73,13.65 U$1.P$23 | 43.28,13.18 43.25,13.18 | C9.1 43.28,13.18 | 47.1,21.67 47.1,22.7 v47.16,22.78 | 53.66,11.35 v52.58,11.35 | 7.15,37.26 6.86,36.97 6.86,35.02 U$16.P$15
  Top 0.254: 54.56,11.35 53.61,11.35 | 52.58,10.92 v52.58,11.35 | 22.17,11.16 ESP32C3-MINI-1.P$51 ESP32C3-MINI-1.P$11 | 9,61.4 9.2,61.4 9.2,59.1
  Top 0.305: C7.1 33.83,15.78 | U$17.2 20.36,34.98 19.99,34.61 19.99,33.89 C29.1 20.27,33.5
  Top 0.406: 43.31,17.82 U$1.P$34 | R16.2 6.83,23.96 U$16.P$16 | C22.2 17.95,61.86 C23.2 | U$16.P$200A1B12 7.48,33.9 7.48,35.01 | U$16.P$212B1A12 7.5,27.45 7.5,26.36
  Top 0.457: U$16.P$13 U$16.P$15 | U$16.P$16 U$16.P$14 U$16.P$13 | 3.28,64.87 C26.2 C27.2 | 2.44,35.2 U$16.P$13
  Top 0.559: U$13.P$9 7.44,64.5 7.15,64.8 3.35,64.8 3.28,64.87
  Top 0.61: U$1.P$34 41.1,17.78
  Top 0.813: C23.2 17.98,58.12 v19.81,55.94 | 18.07,61.89 20.4,61.89 20.4,59.75 | 14.35,61.85 14.35,60.44 | 40.5,20.5 40.5,15.1
  Top 1.016: 1.45,35.01 6.87,35.01 | 6.87,35.01 7.48,35.01 7.79,35.01 | 6.86,35.02 6.87,35.02 6.87,35.01 | 1.38,26.36 6.83,26.36 | 6.83,26.36 7.5,26.36 7.7,26.36 7.7,26.35 | U$16.P$16 6.83,26.36 | 2.69,36.8 2.69,24.62 2.71,24.61 6.82,24.61 6.82,26.38 | 6.87,34.99 6.88,34.99 6.88,36.98
  Top 1.27: U$9.P$2 52.43,11.35 54.56,11.35
  Bottom 0.203: v47.16,22.78 v45.09,22.78 | 30.19,2.52 29.49,2.52 v28.33,3.68
  Bottom 0.254: 20.09,21.04 6.9,21.04 6.9,21.03 | 20.09,20.93 20.09,21.01
  Bottom 0.406: 30.27,7.74 30.27,2.52 30.19,2.52
  Bottom 1.016: 2.72,24.13 6.88,24.13 6.88,26.35 2.71,26.35 | 2.38,26.35 2.71,26.35 | 2.71,26.35 2.71,34.99 7.01,34.99 7.01,34.96 | 2.69,24.11 2.69,26.33
  Bottom 1.27: 54.56,11.35 v52.58,11.35 51.7,11.35 49.45,13.64
  other vias: 42.44,19.13 45.58,20.46 45.61,15.11 43.5,15.11 42.43,17.78 43.51,20.45 44.22,17.78 44.21,19.11 44.22,16.45 23.05,37.95 28.33,20.95 10.19,12.5 11.66,51.68 11.62,41.58 28.33,16.45 28.33,25.45 28.33,29.84 28.33,34.61 28.33,43.14 3.05,12.75 3.05,17.93 3.05,23.05 9.89,58.98 11.44,58.16 11.16,16.08 11.06,21.08 16.7,22.86 16.7,26.66 16.6,30.66 16.8,19.36 39,15.07 39,17.74 38.91,20.46 46.89,3.68 12.1,6.37 47.67,10.67
  pour Bottom: 46.08,20.93 40.63,20.93 40.63,14.61 46.08,14.61
  pour Top: 40.75,20.93 39.64,20.93 39.64,22.96 35.14,22.96 35.14,18.3 33.19,18.3 33.19,9.82 8.1,9.82 8.1,26.68 5.63,26.68 5.63,34.59 8.09,34.59 8.09,35.84 0.69,35.84 0.69,0.64 58.6,0.58 58.66,14.21 40.82,14.26
  pour Top: 0.9,79.12 0.9,34.23 29.9,34.23 29.9,60.71 5.93,60.71 5.22,59.99 5.22,59.19 4.94,58.92 2.86,58.92 2.5,59.25 2.5,63.26 4.01,64.77 4.04,71.2 7.71,71.2 7.71,74.28 13.08,74.28 13.08,79.12
  pour Top: 30.04,34.24 11.93,34.24 11.93,26.02 0.69,26.02 0.69,24.99 0.69,0.48 30.04,0.48
  pour Bottom: 5.25,59.98 5.25,40.54 5.44,40.35 12.26,40.35 12.26,25.59 8.03,25.59 8.03,35.41 0.83,35.41 0.83,0.69 30.61,0.52 30.71,60.7 5.93,60.67
  pour Bottom: 46,14.17 58.65,14.17 58.65,0.48 30.46,0.48 30.46,74.37 36.14,74.37 36.14,62.75 44.42,62.75 46.28,60.82 46.28,56.93 40.22,56.93 40.22,49.21 46.34,43.09 46.34,39.22 40.22,39.22 40.22,31.38 46.28,25.32 46.28,21.3 46,21.3
  pour Top: 8.97,63.32 8.97,64.17 8.19,64.95 7.29,64.95 7.29,63.32
  pour Top: 29,14 37.5,14 37.5,2.8 29,2.8
IO2
  Top 0.305: ESP32C3-MINI-1.P$5 21.97,5.57 R26.2
IO10  (via drill 0.6)
  Top 0.203: ESP32C3-MINI-1.P$16 17.69,12.49 18.1,12.9 18.9,12.9 19.4,13.4 19.4,16.62 17.98,18.03 15.88,18.03 15.32,18.59 15.32,38.38 14.3,39.4 7.32,39.4 7.04,39.67 7.04,44.27 7.82,45.06 7.82,47.47 7.06,48.23 7.06,50.49 7.44,50.88 9.12,50.88 9.47,51.23 9.47,53.62 9.83,53.98 11.84,53.98 12.88,52.93 17.07,52.93 v17.8,53.67 | v27.15,55.88 28.1,55.88 D1.DI
  Bottom 0.203: v17.8,53.67 24.94,53.67 v27.15,55.88
N$1
  Top 0.152: U$2.P$31 47.59,31.65 47.59,30.94 47.74,30.79 47.74,29.3 48.2,28.84 48.2,25.1 48,24.9 U$29.P$1
N$2
  Top 0.152: U$24.P$1 48.4,47.1 47.9,47.6 47.9,48.5 47.6,48.8 47.6,49.42 U$3.P$31
N$3
  Top 0.152: U$2.P$29 46.63,31.65 46.63,30.94 46.48,30.79 46.48,29.41 47.6,28.3 U$30.P$1
N$4
  Top 0.152: U$3.P$29 46.6,49.44 46.6,47.59 48,46.18 48,43.4 47.8,43.2 U$25.P$1
N$5
  Top 0.152: 46.1,31.64 U$2.P$28 46.14,30.94 46.02,30.82 46.02,29.22 47,28.25 U$31.P$1
N$6
  Top 0.152: U$3.P$28 46.13,46.45 47.3,45.28 U$26.P$1
N$7
  Top 0.152: U$2.P$26 45.19,31.65 45.19,31.05 44.69,30.56 44.69,29.51 45,29.2 45,28.6 45.5,28.1 U$32.P$1
N$8
  Top 0.152: U$3.P$26 45.19,49.43 45.19,48.81 44.77,48.39 44.77,47.59 45.14,47.22 45.14,46.28 45.36,46.05 U$28.P$1
N$9
  Top 0.152: U$1.P$6 45.65,22.32 45.74,22.42 45.74,25.34 44.2,26.89 44.2,27.38 C1.1
N$10
  Top 0.152: 44.21,27.41 C1.2 44.26,28.37 44.21,28.42 U$2.P$24
N$11
  Top 0.152: U$2.P$6 45.65,40.14 45.73,40.22 45.73,42.75 44.18,44.3 44.18,44.92 C2.1
N$12
  Top 0.152: C2.2 44.16,48.63 44.22,48.69 U$3.P$24
N$13
  Top 0.152: U$4.P$31 47.59,67.21 47.59,66.67 47.94,66.32 47.94,65.44 48.2,65.19 U$20.P$1
N$14
  Top 0.152: U$4.P$29 46.6,67.22 46.6,65.56 47.51,64.64 47.51,61.18 U$21.P$1
N$15
  Top 0.152: U$4.P$28 46.14,66.45 46.25,66.33 46.25,64.12 46.8,63.58 U$22.P$1
N$16
  Top 0.152: U$23.P$1 45,65.4 44.9,65.5 44.9,66.2 45.2,66.5 45.2,67.2 U$4.P$26
N$17
  Top 0.152: U$3.P$6 45.65,61.52 45.25,61.92 43.85,61.92 43.71,62.06 43.71,62.67 C3.1
N$18
  Top 0.152: 43.66,63.78 43.66,64.66 44.26,65.25 44.26,67.18 U$4.P$24
  Top 0.254: 43.66,63.78 43.69,63.78 C3.2
N$19
  Top 0.203: Q1.1 47.07,6.99 R1.2 47.06,9.18 46.95,9.29 45.41,9.29 45.23,9.12 44.41,9.12 44.28,9.24 44.27,12.26 44.69,12.68 U$1.P$25 | C8.2
  Top 0.254: Q1.1 C8.2
N$20
  Top 0.203: R1.1 45.77,8.57 44.93,8.57 44.51,8.15 | U$1.P$24 44.2,13.88 44.2,12.87 43.79,12.46 43.8,8.86 44.51,8.15 | 44.51,8.15 44.44,8.08 44.44,5.39 | C9.2 44.44,5.37 44.44,5.39 | Q1.3 44.44,5.39
N$21
  Top 0.203: U$16.P$210B5 12.01,28.92 12.24,28.69 12.24,24.31 11.94,24 9.64,24 R16.1
  Top 0.254: U$16.P$210B5 arc-90 7.46,28.93
N$22
  Top 0.203: 7.47,31.94 11.79,31.94 12.78,32.93 R22.1
  Top 0.254: U$16.P$203A5 arc-90 7.47,31.94
N$23
  Top 0.406: U$17.3 21.31,35.75 21.68,35.38 23.74,35.38 23.86,35.26 23.86,33.91 L1.P$2
N$24
  Top 0.305: R23.2 R24.2 25.11,40.08 23.59,40.08 23.13,40.54 19.75,40.54 19.41,40.2 U$17.6
N$25  (via drill 0.3)
  Top 0.203: v41.13,12.64 41.91,11.86 41.91,9.31 41.2,8.6 R2.2 40.92,8.58 R3.1 | U$1.P$31 47.59,12.96 v48.23,12.33
  Bottom 0.152: v41.13,12.64 41.26,12.51 45.19,12.51 45.72,11.98 45.72,10.86 45.98,10.6 46.7,10.6 47.06,10.96 47.06,11.97 47.37,12.27 48.17,12.27 v48.23,12.33
N$27
  Top 0.254: T1.1 30,7.8 30.6,7.2 32.98,7.2 R6.1
N$28
  Top 0.203: R36.2 16.03,55.54 R12.2 16.1,55.54 16.1,56.44 15.95,56.59 15.75,56.59 15.61,56.73 R35.1
N$29
  Top 0.203: R34.1 43.12,25.09 C14.1 43.13,23.8 R33.1 43.16,23.09 43.27,22.97 43.7,22.97 44.21,22.46 U$1.P$9 U$1.P$8
N$30
  Top 0.152: 44.2,39.45 44.2,40.2 43.76,40.63 42.56,40.63 42.47,40.72 R31.1
  Top 0.203: 44.2,39.45 U$2.P$9 U$2.P$8 | R32.1 41.3,42.69 41.66,43.04 C15.1 R31.1
N$31
  Top 0.152: 44.2,75.02 U$4.P$9 | 43.7,76.76 R27.1
  Top 0.203: 44.2,75.02 44.2,76.01 R27.1 43.69,76.77 | U$4.P$9 U$4.P$8
  Top 0.254: R28.1 43.6,77.88 C17.1 43.66,76.8 R27.1
N$32
  Top 0.152: U$4.P$4 46.61,76.3 46.89,76.58 47.61,76.58 U$15.1
N$33
  Top 0.203: U$13.P$4 7.17,58.42 JPA.P$2
N$34
  Top 0.406: C24.1 11.43,61.67 10.79,62.31 9.5,62.31 9.49,62.32
  Top 1.118: 8.62,62.32 9.49,62.32
  pour Top: 13.11,73.46 8.99,73.46 8.53,73 8.53,65.49 9.6,64.43 9.6,63.17 9.3,62.87 8.08,62.87 8.08,61.8 9.41,61.8 9.6,61.61 11.73,61.61 11.31,61.76 11.33,67.23 13.08,67.23
N$35  (via drill 0.4)
  Top 0.203: C24.2 12.41,59.69 v12.65,59.93 | v5.37,59.85 5.94,59.85 6.27,60.18 U$13.P$6
  Bottom 0.203: v12.65,59.93 11.85,60.73 5.68,60.73 5.37,60.43 v5.37,59.85
N$37
  Top 0.203: ESP32C3-MINI-1.P$18 16.09,11.89 IO4.TP
N$38
  Top 0.813: 18.05,61.87 14.35,61.87 14.35,61.89
N$39
  Top 0.203: R17.1 C28.1 6.17,50.32 R18.2
N$40
  Top 0.203: ESP32C3-MINI-1.P$19 15.29,11.99 17.2,13.9 17.2,14.8 IO5.TP
N$41  (via drill 0.4)
  Top 0.152: ESP32C3-MINI-1.P$23 12.09,12.31 v11.9,12.5 | v16.3,14.3 IO9.TP
  Bottom 0.152: v11.9,12.5 14.5,12.5 v16.3,14.3
N$43
  Top 0.152: U$3.P$1 48.05,57.75 48.2,57.9 U$20.P$2
N$44
  Top 0.152: U$3.P$2 47.57,57.67 47.9,58 47.9,58.7 47.5,59.1 U$21.P$2
N$45
  Top 0.152: U$3.P$4 46.61,59.81 46.8,60 U$22.P$2
N$46
  Top 0.152: U$3.P$5 46.13,61.8 45.53,62.4 44.88,62.4 44.56,62.71 44.56,63.72 U$23.P$2
N$47
  Top 0.152: U$2.P$1 48.05,40.02 48.4,40.38 U$24.P$2
N$48
  Top 0.152: U$2.P$2 47.57,40.05 47.8,40.27 47.8,41 47.7,41.1 47.7,42.55 U$25.P$2
N$49
  Top 0.152: U$2.P$4 46.61,40.19 46.5,40.3 46.5,40.9 46.8,41.2 47,41.2 47.3,41.5 U$26.P$2
N$50
  Top 0.152: U$2.P$5 46.15,39.47 46.15,42.84 45.12,43.87 45.12,44.74 45.37,44.99 U$28.P$2
N$51
  Top 0.152: 48.05,24.2 U$29.P$2 48,23.7 48.3,23.4 48.3,22.4 48.05,22.15 U$1.P$1
N$52
  Top 0.152: U$1.P$2 47.57,22.27 47.8,22.5 47.8,23.2 47.4,23.6 47.4,25.35 U$30.P$2
N$53
  Top 0.152: U$1.P$4 46.58,21.7 46.6,21.7 46.6,22.4 46.5,22.5 46.5,23.1 47,23.6 U$31.P$2
N$54
  Top 0.152: U$1.P$5 46.13,25.48 45.28,26.34 45.28,27.42 U$32.P$2
N$55
  Top 0.203: U$3.P$8 U$3.P$9 44.21,57.76 R29.1 42.68,60.78 C16.1 41.6,60.8 41.33,60.52 39.33,60.52 R30.1
NRST  (via drill 0.6)
  Top 0.254: R3.2 40.92,2.73 v40.18,1.99 | v23.94,10.27 23.94,11.68 23.25,12.37 21.09,12.37 20.9,12.18 20.9,11.29 ESP32C3-MINI-1.P$12
  Bottom 0.254: v40.18,1.99 25.95,1.99 23.91,4.03 23.91,10.25 v23.94,10.27
P3
  Top 0.203: JPB.P$2 8.54,58.8 8.39,58.95 7.82,58.95 7.61,59.16 7.61,60.12 7.63,60.15 7.63,60.7 U$13.P$3
PWM
  Top 0.254: R18.1 6.13,39.03 6.69,38.47 13.87,38.47 14.29,38.05 14.29,14.09 12.9,12.7 12.9,11.29 ESP32C3-MINI-1.P$22
RO  (via drill 0.3)
  Top 0.152: U$1.P$28 46.13,11.52 v46.4,11.26
  Top 0.203: v37.83,12.06 35.98,12.06 v35.73,12.32
  Top 0.254: R7.1 31.74,8.58 T1.2 30,11.21 v30.28,11.48
  Bottom 0.152: v46.4,11.26 46.4,12.6 45.72,13.28 39.69,13.28 v39.6,13.18
  Bottom 0.203: v39.6,13.18 38.95,13.18 v37.83,12.06 | v30.28,11.48 30.28,11.52 30.91,12.29 35.71,12.3 v35.73,12.32
VCC_1  (via drill 0.3, 0.6)
  Top 0.152: 45.17,37.24 v42.44,35.56 U$2.P$34 43.48,35.56 | U$2.P$3 47.09,40.58 v47.19,40.58
  Top 0.203: U$2.P$19 41.81,30.71 42.29,30.71 | U$2.P$20 42.29,30.71 | U$2.P$21 42.77,30.71 | 42.77,30.71 42.29,30.71 | 43.25,30.71 U$2.P$22 43.25,32.92 v43.59,32.92 | 43.25,30.71 42.77,30.71 | 45.17,37.24 U$2.P$7 45.17,40.58 v45.03,40.58 45.03,41.24 44.86,41.41 R31.2 C15.2 | U$2.P$23 43.73,30.71 43.25,30.71 | v41.3,38.18 40.4,38.18 40.01,38.18 | 35.51,39.98 C11.2 | 33.89,35.56 U$6.1
  Top 0.254: C11.2 35.48,39.92 36.9,38.5 39.68,38.5 40.01,38.18 | 49.05,17.78 48.51,17.78 v47.57,16.84
  Top 0.406: R11.1 50.86,12.66 50.86,15.13
  Top 0.813: 40.4,38.2 40.4,38.18 40.4,32.8
  Top 1.016: 49.11,15.2 50.86,15.2 50.86,15.13 | v49.11,17.75 50.6,17.75 | 49.11,20.31 50.71,20.31 | v49.49,25.07 v49.49,27.2 | U$1.P$33 49.05,17.78
  Bottom 0.203: v45.03,40.58 v47.19,40.58
  other vias: 49.07,15.24 49.07,20.35 47.57,20.52 47.57,18.75 47.57,15.04 45.42,38.18 41.3,32.92 45.42,32.92 44.22,35.57 43.51,38.18 42.44,34.21 44.23,34.25 44.21,36.89 42.44,36.89
  pour Bottom: 40.69,38.71 40.65,31.61 46.75,25.59 46.77,14.63 50.37,14.63 50.37,27.81 46.02,32.16 46.02,38.71
  pour Top: 50.71,14.71 58.67,14.71 58.67,30.67 50.03,30.67 48.73,29.38 48.73,20.92 48.69,20.88 46.67,20.88 46.67,14.71
  pour Bottom: 46.8,14.63 58.65,14.63 58.65,31.98 46.8,31.98
  pour Top: 46.08,38.71 33.28,38.71 33.25,24.11 46.05,24.11
VCC_2  (via drill 0.3, 0.6)
  Top 0.152: v49.61,45 v49.61,42.82 49.64,42.79 | 40.5,56 40.5,56.01
  Top 0.203: U$3.P$19 41.81,48.62 42.29,48.62 | U$3.P$20 42.29,48.62 | U$3.P$21 42.77,48.62 | 42.77,48.62 42.29,48.62 | 43.25,48.62 U$3.P$22 43.25,50.41 arc-90 v43.51,50.67 | 43.25,48.62 42.77,48.62 | U$3.P$7 45.17,58.2 v45.01,58.33 45.01,59.13 44.87,59.28 R29.2 43.98,60.78 C16.2 | v47.24,58.33 47.09,58.18 U$3.P$3 | U$3.P$23 43.73,48.62 43.25,48.62 | v41.22,56.01 40.5,56.01 40.06,56.01 | 35.66,57.86 C12.2 | 51.47,32.92 50.56,32.92
  Top 0.254: C19.2 53.68,32.4 | C12.2 36.8,56.2 | U$2.P$33 47.59,35.56 v47.59,34.62 | U$3.P$7 45.17,56.33 v45.49,56.01 | v42.37,53.34 U$3.P$34
  Top 0.305: 36.77,56.16 36.8,56.2
  Top 0.406: R10.1 51.47,32.92
  Top 0.813: 40.5,56 40.5,50.6
  Top 1.016: v49.07,32.92 50.56,32.92 | v49.07,35.59 50.98,35.59 | 49.11,38.21 51.59,38.21
  Bottom 0.203: v45.01,58.33 v47.24,58.33
  other vias: 49.07,38.25 47.57,38.3 47.56,36.51 47.57,32.87 41.22,50.67 45.49,50.67 43.43,56.01 42.37,54.71 42.37,51.99 44.2,51.99 44.22,54.71 44.25,53.34
  pour Bottom: 40.69,56.46 40.7,49.35 46.8,43.26 46.79,32.46 50.37,32.46 50.37,45.57 46.02,49.91 46.02,56.46
  pour Top: 50.63,32.46 58.67,32.46 58.67,48.27 49.91,48.27 48.81,47.17 48.81,38.71 46.75,38.71 46.75,32.46
  pour Bottom: 46.8,32.46 58.65,32.46 58.65,49.68 46.8,49.68
  pour Top: 46.08,56.46 33.34,56.44 33.35,41.61 46.09,41.63
VCC_3  (via drill 0.6)
  Top 0.152: 47.4,53.31 U$3.P$33 | 40.5,73.8 41.11,73.8 v41.15,73.76 | U$4.P$3 47.09,75.59 47.3,75.8 48.4,75.8 48.6,76 48.6,77.3 48.5,77.4 46.23,77.4 45.76,77.87 C17.2
  Top 0.203: U$4.P$19 41.81,66.56 42.29,66.56 | U$4.P$20 42.29,66.56 | U$4.P$21 42.77,66.56 | 42.77,66.56 42.29,66.56 | 43.25,66.56 U$4.P$22 43.25,71.12 U$4.P$34 | 43.25,66.56 42.77,66.56 | U$4.P$34 45.17,72.94 U$4.P$7 | U$4.P$23 43.73,66.56 43.25,66.56 | U$4.P$34 43.38,71.12
  Top 0.254: 35.55,75.72 C13.2 | 39.66,73.8 41.11,73.8 v41.15,73.76 | R9.1 51.51,50.63 50.8,50.63 | C17.2 44.96,76.8 R27.2 45.17,76.59 U$4.P$7 | 47.4,53.31 47.57,53.31 v47.57,52.4
  Top 0.305: 33.78,71.01 U$8.1 | 38.34,71.06 v38.37,71.08 | v38.37,73.34 38.32,73.3 37.5,73.3 37.49,73.29 36.7,73.29 35.55,74.75 35.55,75.72
  Top 0.813: 40.5,73.8 40.5,68.4
  Top 1.016: v49.07,55.93 51.36,55.93 | v49.07,53.26 51.07,53.26 | 48.4,50.63 50.8,50.63
  other vias: 47.55,56.08 47.57,54.28 47.57,50.62 45.57,73.76 41.15,68.47 45.57,68.47 44.27,71.12 42.43,71.11 43.43,68.47 43.36,73.8 44.27,72.47 42.46,72.47 42.42,69.79 44.27,69.79 49.07,50.67 38.37,68.29 38.37,65.66 49.6,61.3 49.6,63.5
  pour Bottom: 40.61,74.3 40.61,67.21 46.71,61.11 46.71,50.22 50.37,50.22 50.37,63.47 46.1,67.74 46.1,74.3
  pour Top: 50.67,50.25 58.67,50.25 58.67,66.03 49.8,66.03 48.81,65.04 48.81,56.46 46.67,56.46 46.67,50.25
  pour Top: 33.37,74.28 46.06,74.3 46.1,59.51 33.41,59.5
  pour Bottom: 46.72,50.23 58.65,50.23 58.65,66.03 46.72,66.03
  pour Bottom: 46.1,74.28 46.1,63.56 35.94,63.56 35.9,63.56 35.66,63.8 35.66,69 34.97,69.69 34.97,72.56 35.51,73.1 35.51,74.28
VCC_4  (via drill 0.6)
  Top 0.152: R21.2 R20.2 R19.2 R14.2
  Top 1.016: U$4.P$33 50.7,71.12 v50.7,75.6 | 48.84,68.76 51.18,68.76 | 48.79,73.69 51.13,73.69
  other vias: 28.5,77.69 29.49,76.7 28.5,75.7 29.49,74.71 28.5,73.72 28.5,68.69 29.49,67.7 28.5,66.71 29.49,65.72 28.5,64.73 29.49,63.74 50.7,78.1 47.58,73.85 47.58,72.04 47.58,70.16 47.58,68.39
  pour Bottom: 46.75,68.01 48.2,66.56 58.67,66.56 58.67,78.94 24.12,78.94 24.12,62.9 30.06,62.9 30.06,74.75 46.75,74.75
  pour Top: 24.22,78.91 24.22,61.7 29.93,61.7 29.93,78.91
  pour Top: 46.71,74.22 46.71,68 48.94,68 48.94,66.76 58.55,66.76 58.55,79.14 48.95,79.14 48.95,74.22
VCORE
  Top 0.152: R19.1 R20.1 R21.1 19.7,76.73 19.13,76.16 | R19.1 R14.1 21.45,64.82 C23.1 17.95,64.86 | L2.P$2 18.21,69.95 19.36,68.81 21.5,68.81 R19.1
  Top 0.203: C22.1 12.56,64.86 12.42,65 12.42,60.91 12.6,60.73 13.11,60.73 13.39,60.45 13.39,59.03 13.92,58.5 R35.2
  pour Top: 23.22,78.94 14.17,78.94 14.17,66.22 12.34,66.22 12.34,63.47 20.08,63.47 20.05,61.7 23.19,61.7
VDD5  (via drill 0.6)
  Top 0.203: 32.15,18.8 U$5.3 | 6.55,61.39 U$13.P$7 | v30.73,61.73 28.28,59.28 24.59,59.28 24.58,59.27 D1.VCC 24.56,57.49 C32.1
  Top 0.254: 6.35,61.39 6.35,61.95 | 6.55,61.39 6.55,61.81 | 18.21,35.49 18.26,35.49
  Top 0.305: U$8.3 31.63,61.71 | 31.63,61.71 U$7.3 | U$7.3 U$6.3 | U$6.3 U$5.3 31.63,15.28 C7.2 | 32.15,18.8 31.56,19.38 C4.2 31.63,33.43 U$6.3 | C5.2 31.63,51.22 U$7.3 | U$7.3 31.65,54.31 C6.2 31.61,68.69 31.61,72.03 31.62,72.03 | v30.73,61.73 31.6,61.73 31.63,61.71 | U$17.1 19.41,36.5 | 18.21,33.86 C29.2 | 21.3,39.21 U$17.4
  Top 0.406: 21.3,39.21 21.3,38.08 21.15,37.92 19.8,37.92 19.41,37.53 U$17.1 18.26,35.49 | 18.21,33.86 18.21,35.49 v17.9,35.8
  Top 0.457: U$16.P$211B4A9 9.45,28.22 v9.63,28.04 | U$16.P$201A4B9 9.65,33.12 v9.65,33.36 | v7.28,67.96 7.28,68.43 6.6,69.1 5.27,69.1 | 5.27,69.1 C27.1 | 5.27,69.1 5.27,66.84 C26.1 5.27,66.66
  Top 1.676: 31.9,61.7 30.7,61.7
  Bottom 0.254: 11.06,34.59 v10.99,34.52
  Bottom 0.406: 5.45,61.73 v4.55,62.64 | 11,34.5 v10.99,34.52 16.62,34.52 v17.9,35.8 | 3.76,43.41 3.79,43.41
  Bottom 0.457: v10.99,34.52 10.99,36.91 9.56,38.33 2.92,38.33 2.41,38.84 2.41,63.09 v7.28,67.96
  Bottom 0.61: 3.79,43.41 C34.+ | C34.+ 3.79,40.56 | C34.+ 2.34,41.91
  Bottom 0.813: v30.73,61.73 5.45,61.73
  other vias: 9.64,34.53 9.61,26.89 10.97,26.9 7.26,69.2 7.28,66.71 4.55,61.46 3.98,60.3 10.98,33.36 10.98,28.04
  pour Bottom: 8.71,35.31 8.71,26.05 11.77,26.05 11.77,35.31
  pour Top: 4.81,70.45 4.81,65.54 7.95,65.54 7.95,70.45
  pour Top: 6.83,64.07 4.47,64.07 3.2,62.79 3.2,59.59 4.58,59.59 4.58,60.15 5.82,61.38 6.83,61.38
  pour Bottom: 0.75,79.35 23.38,79.35 23.38,61.19 5.56,61.19 4.69,60.31 4.69,40.22 5.16,39.75 11.8,39.75 11.8,35.2 8.81,35.2 8.81,35.99 0.75,35.99
  pour Top: 9.26,34.91 11.38,34.91 11.38,32.98 9.26,32.98
  pour Top: 9.25,28.44 11.38,28.44 11.38,26.49 9.25,26.49
  pour Top: 30.66,78.91 30.66,14.53 32.72,14.53 32.72,78.91
VDD33  (via drill 0.6)
  Top 0.254: ESP32C3-MINI-1.P$3 25.49,3.99 25.86,4.37 25.86,5.31 | 25.86,5.31 25.86,7.7 | 25.86,7.7 25.86,10.1 25.45,10.5 25.45,12.96 R8.2 25.32,17.52 v26,18.2 26.02,18.18 | R25.2 25.84,7.68 25.86,7.7 | R26.1 25.84,5.3 25.86,5.31 | 23.64,27.59 C30.2 23.88,27.82
  Top 0.305: C30.2 23.28,27.66 | 23.88,30.17 L1.P$1 23.95,30.13 26,30.13 26.34,30.47 26.34,34.83 25.16,36.01 R23.1
  Top 0.406: 23.88,30.17 23.88,27.82 | v26,24.7 26,25.26 C30.2
  Bottom 0.254: v26,18.2 v26,24.7
VDD33I
  Top 0.203: R15.2 C25.1 6.17,57.7 6.17,58.85 6.72,59.4 U$13.P$5
VDDIO18_1  (via drill 0.3, 0.4)
  Top 0.203: U$1.P$11 U$1.P$12 42.77,22.52 40.69,22.52 | 33.75,22.29 C10.1 v32.49,22.36 32.47,22.33 | U$1.P$32 48.04,13.32 48.32,13.04 48.83,13.04 49,12.88 49,12.08 48.61,11.69 | 33.83,22.36 33.83,23.31 34.21,23.7 34.24,23.67 36.45,23.67 37.6,22.52 40.69,22.52 | U$1.P$30 47.09,12.73 47.88,11.63 48.55,11.63 48.61,11.69 | 48.61,11.69 48.61,11.44 v49,11.05 47.72,9.77 44.95,9.77 44.77,9.95 44.77,10.77 45.65,11.64 U$1.P$27 | 32.1,11.45 v32.09,11.47 | R6.2 32.12,10.27 R7.2 | R34.2 40.69,22.52
  Top 0.254: R7.2 32.1,11.45
  Top 0.406: 33.83,22.28 C10.1 33.83,22.36 U$5.2
  Bottom 0.203: v32.49,22.36 32.49,16.36 35.8,13.04 36.37,13.04 36.6,12.81 36.6,11.32 | v32.09,11.47 32.15,11.4 36.52,11.4 36.6,11.32 | 36.6,11.32 36.6,11.29 36.84,11.05 44.59,11.04 45.8,9.77 47.71,9.77 48.98,11.04 48.97,11.02 v49,11.05
VDDIO18_2  (via drill 0.3, 0.4)
  Top 0.152: 45.54,30.16 v45.38,30.33 45.65,30.6 U$2.P$27 | v34.95,38.49 33.86,37.49 U$6.2
  Top 0.203: C11.1 33.76,40.03 33.76,41 33.87,41.11 36.49,41.11 37.38,40.22 40.63,40.22 | U$2.P$32 48.05,31.17 48.37,30.85 48.37,30.35 v48.35,30.33 | U$2.P$30 47.09,30.37 v47.13,30.33 | U$2.P$27 | v45.38,30.33 45.5,30.2 45.5,29.1 46.3,28.3 46.3,27.06 v45.91,26.67 | 40.63,40.22 42.78,40.22 U$2.P$12 U$2.P$11 | R32.2 39.34,40.23 40.63,40.22
  Top 0.406: U$6.2 33.83,39.96 C11.1
  Bottom 0.254: v45.38,30.33 v47.13,30.33 v48.35,30.33 | v34.95,38.49 34.95,37.75 34.5,37.3 34.5,33.9 35.41,32.99 35.41,28.27 37.01,26.67 v45.91,26.67
VDDIO18_3  (via drill 0.3, 0.4)
  Top 0.152: v45.77,44.28 45.77,44.49
  Top 0.203: C12.1 33.83,57.73 33.83,58.71 33.98,58.86 34,58.85 36.63,58.85 37.5,57.98 40.44,57.98 | U$3.P$30 47.09,48.24 v47.26,48.12 | U$3.P$32 48.06,48.96 48.39,48.63 48.39,48.23 v48.6,48.12 | v35.22,56.13 35.22,55.53 34.81,55.23 U$7.2 | U$3.P$27 45.65,48.35 v45.41,48.12 45.52,48.02 45.52,46.44 46.14,45.82 46.14,44.86 45.77,44.49 | 40.44,57.98 42.77,57.98 U$3.P$12 U$3.P$11 | R30.2 39.32,57.99 40.44,57.98
  Top 0.406: U$7.2 C12.1
  Bottom 0.203: v45.41,48.12 v47.26,48.12 v48.6,48.12
  Bottom 0.254: v35.22,56.13 35.22,55.52 34.4,55 34.4,51.8 35,51.2 35,45.72 36.44,44.28 v45.77,44.28
VDDIO18_4  (via drill 0.3, 0.4)
  Top 0.152: U$4.P$27 | U$4.P$27 45.64,65.88 v45.59,65.88 | U$15.2 47.18,78.72 40.21,78.72 39.81,78.32 39.81,75.83
  Top 0.203: U$4.P$27 | U$4.P$30 47.09,66.56 47.24,66.41 v47.24,65.88 | U$4.P$32 48.05,66.82 48.48,66.4 48.48,65.9 v48.6,65.88
  Top 0.254: v45.59,65.88 45.7,65.82 45.7,63.57 v45.24,63.11 | 40.88,75.83 42.77,75.83 U$4.P$12 U$4.P$11 | 40.88,75.83 39.81,75.83 37.12,75.83 36.07,76.89 34.15,76.89 33.82,76.56 C13.1 | R28.2 40.88,75.83 | v35.1,73.91 33.98,73.91 33.83,74.07
  Top 0.406: U$8.2 33.83,74.07 C13.1
  Bottom 0.203: v45.59,65.88 v47.24,65.88 v48.6,65.88
  Bottom 0.254: 35.19,68.81 34.5,69.5 34.5,72.7 35.1,73.3 v35.1,73.91 | 35.19,68.81 35.2,68.8 | v45.24,63.11 35.65,63.11 35.19,63.58 35.19,68.81
(copper drawn outside any net)
  shapes: Top area x4

### Text on the board
tNames: aSiNine / Pyramid | V0.2